# EAGLE design Board1_DustCounter (EAGLE 7.5.0)
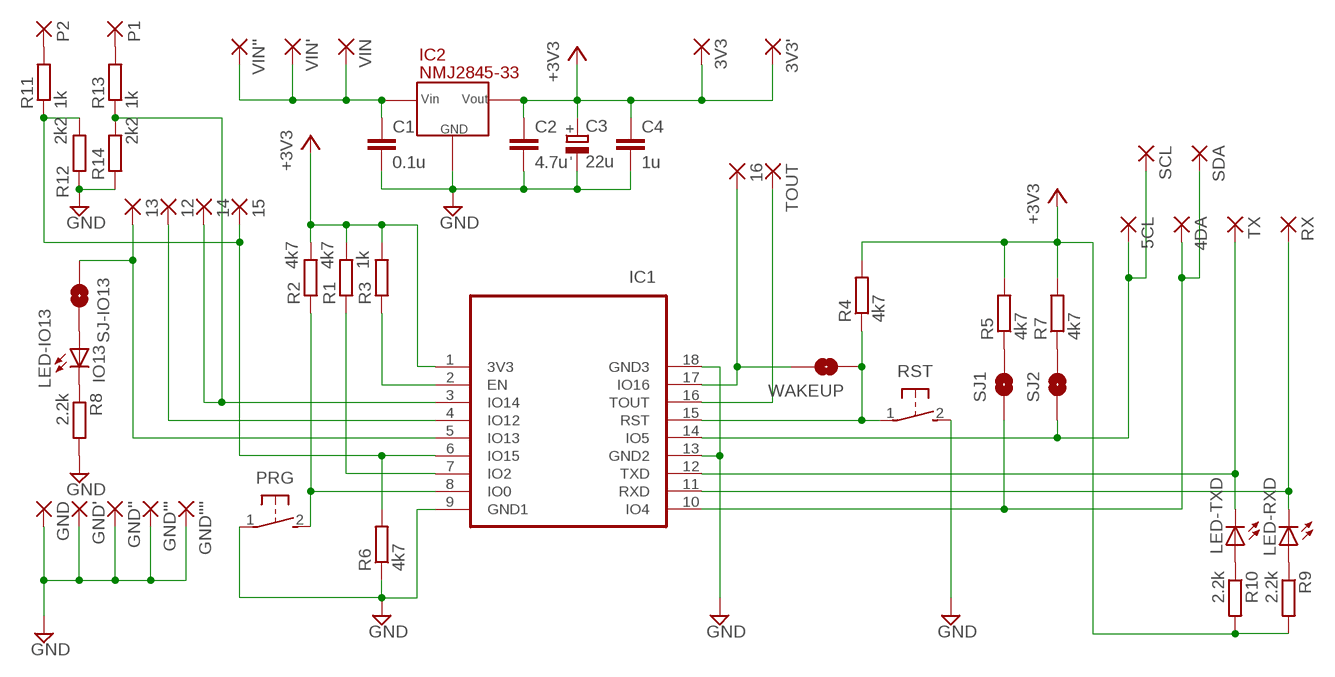
[diagram p0: schematic, sheet 1]

## Parts
3V3  1,6/0,8  [1,6/0,8]
3V3'  1,6/0,8  [1,6/0,8]
4DA  1,6/0,8  [1,6/0,8]
5CL  1,6/0,8  [1,6/0,8]
12  1,6/0,8  [1,6/0,8]
13  1,6/0,8  [1,6/0,8]
14  1,6/0,8  [1,6/0,8]
15  1,6/0,8  [1,6/0,8]
16  1,6/0,8  [1,6/0,8]
C1  0.1u  C-EUC0603  [C0603]
C2  4.7u  C-EUC0805  [C0805]
C3  22u  OS-CON/C6C  [C6]
C4  1u  C-EUC0603  [C0603]
GND  1,6/0,8  [1,6/0,8]
GND'  1,6/0,8  [1,6/0,8]
GND''  1,6/0,8  [1,6/0,8]
GND'''  1,6/0,8  [1,6/0,8]
GND''''  1,6/0,8  [1,6/0,8]
IC1  ESP-WROOM-02FRONT-FACE  [FRONT-FACE]
IC2  NMJ2845-33  NJM2845DL1  [TO-252-3]
LED-IO13  IO13  LEDCHIP-LED0603  [CHIP-LED0603]
LED-RXD  R  LEDCHIP-LED0603  [CHIP-LED0603]
LED-TXD  T  LEDCHIP-LED0603  [CHIP-LED0603]
P1  1,6/0,8  [1,6/0,8]
P2  1,6/0,8  [1,6/0,8]
PRG  SWITCH-TACTILESW  [SWITCH-TACTILE]
R1  4k7  R-EU_R0603  [R0603]
R2  4k7  R-EU_R0603  [R0603]
R3  1k  R-EU_R0603  [R0603]
R4  4k7  R-EU_R0603  [R0603]
R5  4k7  R-EU_R0603  [R0603]
R6  4k7  R-EU_R0603  [R0603]
R7  4k7  R-EU_R0603  [R0603]
R8  2.2k  R-EU_R0603  [R0603]
R9  2.2k  R-EU_R0603  [R0603]
R10  2.2k  R-EU_R0603  [R0603]
R11  1k  R-EU_R0603  [R0603]
R12  2k2  R-EU_R0603  [R0603]
R13  1k  R-EU_R0603  [R0603]
R14  2k2  R-EU_R0603  [R0603]
RST  SWITCH-TACTILESW  [SWITCH-TACTILE]
RX  1,6/0,8  [1,6/0,8]
SCL  1,6/0,8  [1,6/0,8]
SDA  1,6/0,8  [1,6/0,8]
SJ1  SDA/PU  SOLDERJUMPERNO  [SJ_2S-NO]
SJ2  SCL/PU  SOLDERJUMPERNO  [SJ_2S-NO]
SJ-IO13  SOLDERJUMPERNO  [SJ_2S-NO]
TOUT  1,6/0,8  [1,6/0,8]
TX  1,6/0,8  [1,6/0,8]
VIN  1,6/0,8  [1,6/0,8]
VIN'  1,6/0,8  [1,6/0,8]
VIN''  1,6/0,8  [1,6/0,8]
WAKEUP  SOLDERJUMPERNO  [SJ_2S-NO]

## Nets
+3V3 [3V3]: 3V3'.1(P) 3V3.1(P) C2.1 C3.+ C4.1 IC1.1(3V3) IC2.VOUT R1.2 R2.2 R3.2 R4.2 R5.2 R7.2 R9.2 R10.2
GND [GND]: C1.2 C2.2 C3.- C4.2 GND''''.1(P) GND'''.1(P) GND''.1(P) GND'.1(P) GND.1(P) IC1.9(GND1) IC1.13(GND2) IC1.18(GND3) IC2.GND PRG.1 R6.1 R8.2 R12.1 R14.1 RST.2
N$1: IC1.2(EN) R3.1
N$2: IC1.8(IO0) PRG.2 R2.1
N$3: IC1.7(IO2) R1.1
N$4: 4DA.1(P) IC1.10(IO4) SDA.1(P) SJ1.1
N$5: IC1.11(RXD) LED-RXD.C RX.1(P)
N$6: IC1.12(TXD) LED-TXD.C TX.1(P)
N$7: 5CL.1(P) IC1.14(IO5) SCL.1(P) SJ2.1
N$8: IC1.15(RST) R4.1 RST.1 WAKEUP.1
N$9: IC1.16(TOUT) TOUT.1(P)
N$10: 16.1(P) IC1.17(IO16) WAKEUP.2
N$11: R5.1 SJ1.2
N$12: R7.1 SJ2.2
N$13: LED-IO13.A SJ-IO13.2
N$15: 12.1(P) IC1.4(IO12)
N$16: LED-IO13.C R8.1
N$17 [Vin]: C1.1 IC2.VIN VIN''.1(P) VIN'.1(P) VIN.1(P)
N$18: 13.1(P) IC1.5(IO13) SJ-IO13.1
N$19: 14.1(P) IC1.3(IO14) R13.1 R14.2
N$22: LED-TXD.A R10.1
N$23: P2.1(P) R11.2
N$24: LED-RXD.A R9.1
N$25: P1.1(P) R13.2
N$26: 15.1(P) IC1.6(IO15) R6.2 R11.1 R12.2

## Library data of the parts
3V3 3V3' 4DA 5CL 12-16 GND GND' GND'' GND''' GND'''' P1 P2 RX SCL SDA TOUT TX VIN VIN' VIN'' = wirepad:1,6/0,8: THROUGH-HOLE PAD
C1 C4 = _temp:C-EU: CAPACITOR, European symbol
C2 = resistor:C-EU: CAPACITOR, European symbol
C3 = OS-CON:OS-CON/C6
IC1 = esp-wroom-02:ESP-WROOM-02: WiFi module - ESP-WROOM-02
IC2 = NJM2845DL1:NJM2845DL1: New JRC NJM2845DL1 LDO Three-terminal regulator.
LED-IO13 LED-RXD LED-TXD = adafruit:LED: LED OSRAM: - CHIPLED LG R971, LG N971, LY N971, LG Q971, LY Q971, LO R971, LY R971 LH N974, LH R974 LS Q976, LO Q976, LY Q976 LO Q996 - Hyper CHIPLED LW Q18S LB Q993, LB Q99A, LB R99A - SideLED LS A670, LO A670, LY A670, LG A670, LP A670 LB A673, LV A673, LT A673, LW A673 LH A674 LY A675 LS A676, LA A676, LO A676, LY A676, LW A676 LS A679, LY A679, LG A679 - Hyper Micro SIDELED® LS Y876, LA Y876, LO Y876, LY Y876 LT Y87S - SmartLED LW L88C, LW L88S LB L89C, LB L89S, LG L890 LS L89K, LO L89K, LY L89K LS L896, LA L896, LO L896, LY L896 - TOPLED LS T670, LO T670, LY T670, LG T670, LP T670 LSG T670, LSP T670, LSY T670, LOP T670, LYG T670 LG T671, LOG T671, LSG T671 LB T673, LV T673, LT T673, LW T673 LH T674 LS T676, LA T676, LO T676, LY T676, LB T676, LH T676, LSB T676, LW T676 LB T67C, LV T67C, LT T67C, LS T67K, LO T67K, LY T67K, LW E67C LS E67B, LA E67B, LO E67B, LY E67B, LB E67C, LV E67C, LT E67C LW T67C LS T679, LY T679, LG T679 LS T770, LO T770, LY T770, LG T770, LP T770 LB T773, LV T773, LT T773, LW T773 LH T774 LS E675, LA E675, LY E675, LS T675 LS T776, LA T776, LO T776, LY T776, LB T776 LHGB T686 LT T68C, LB T68C - Hyper Mini TOPLED® LB M676 - Mini TOPLED Santana® LG M470 LS M47K, LO M47K, LY M47K Source: http://www.osram.convergy.de/
PRG RST = tact-switch-2p:SWITCH-TACTILE: tactile switch - 2p
R1-R14 = _temp:R-EU_: RESISTOR, European symbol
SJ1 SJ2 SJ-IO13 WAKEUP = SparkFun:SOLDERJUMPER: Solder Jumper Standard SMD solder jumper. Used to automate production. Two varients : Normally Open and Normally Closed are the same, but have different paste layers. NC will have a large amount of paste and should jumper during reflow.

## Net classes
1 GND: width 0.61 mm
2 3V3: width 0.61 mm
3 Vin: width 0.61 mm

## Board
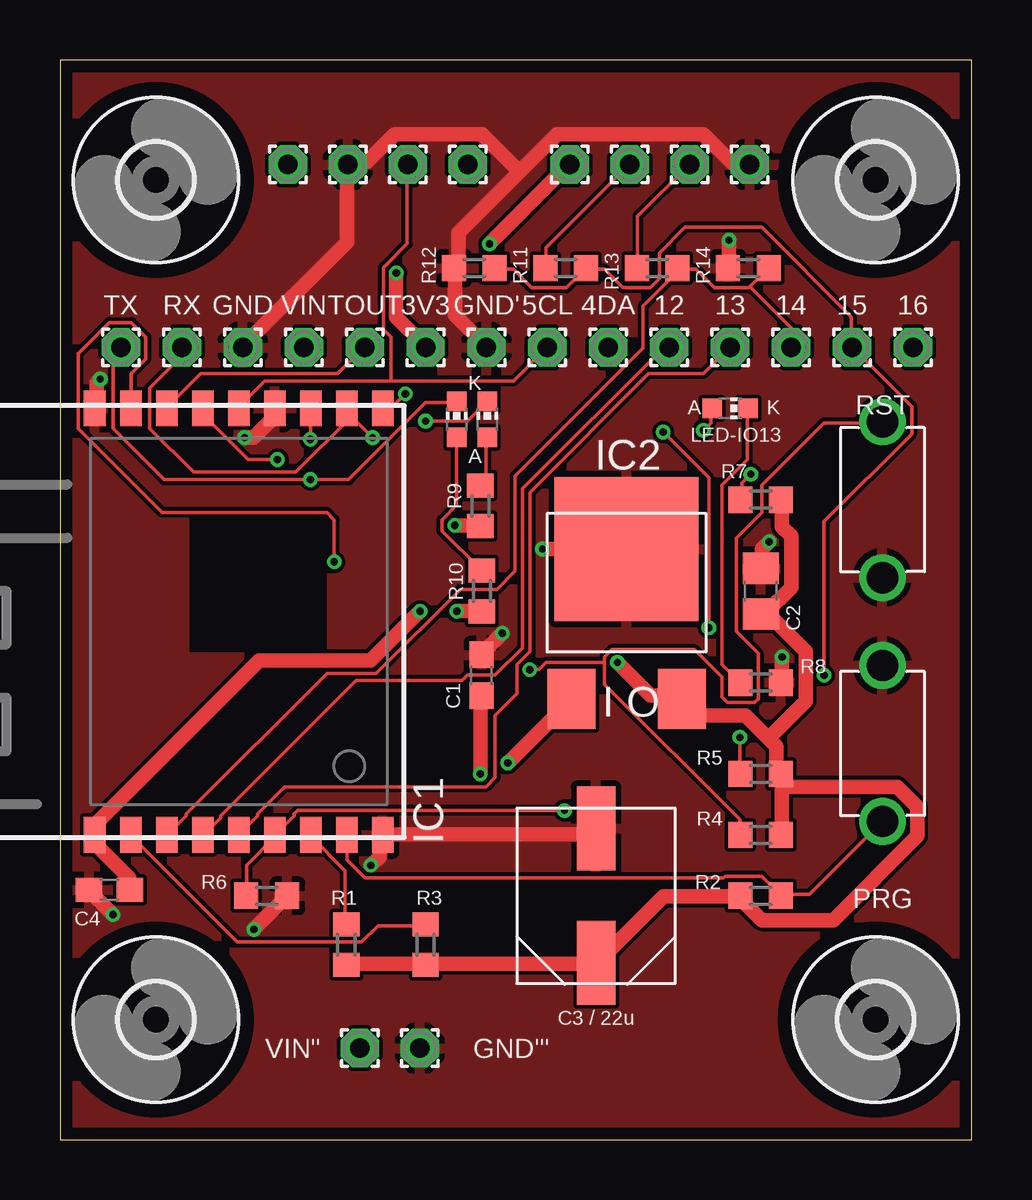
[diagram p1: board, top side]
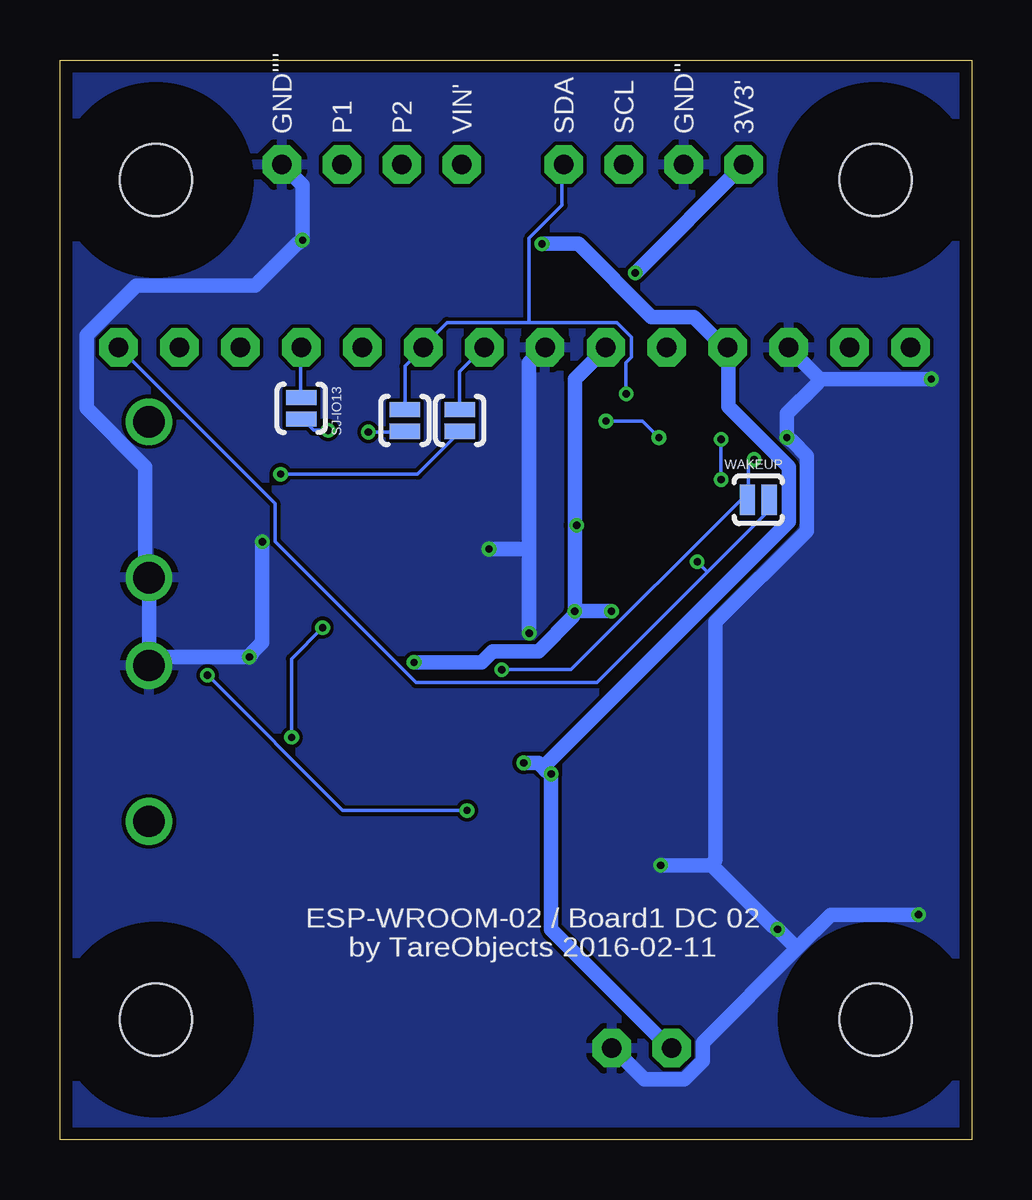
[diagram p2: board, bottom side, seen from below]

Size 38 x 45 mm. Coordinates in mm from the lower left corner, seen from the top.
Outline: 0,0 38,0 38,45 0,45 0,0
Copper layers (1*16): Top 0.035mm / dielectric 1.6mm / Bottom 0.035mm
Design rules "Elecrow_2-layer_PCB_eagle_rule": minimum track width 6mil, minimum drill 12mil, track to track 6mil, track to pad 6mil, pad to pad 6mil, via to via 8mil, smd to smd 0mil, copper to edge 20mil, drill to drill 10mil, minimum pad ring 6mil, minimum via ring 6mil, stop-mask expansion 0mil, vias tented up to drill 100mil, thermal gap 10mil

### Footprints (pad centres in the part's own frame; a part is rotated, then mirrored left to right if it is on the bottom)
1,6/0,8 = drill 0.813 pad 1.6 octagon: 1 0,0
C0603 = smd 1.1 x 1: 1 -0.85,0; 2 0.85,0
C0805 = smd 1.3 x 1.5: 1 -0.95,0; 2 0.95,0
C6 = smd 1.6 x 3.5: + 0,-2.8; - 0,2.8
FRONT-FACE = smd 1.485 x 0.9: 1 -8.893,4.9; 2 -8.893,3.4; 3 -8.893,1.9; 4 -8.893,0.4; 5 -8.893,-1.1; 6 -8.893,-2.6; 7 -8.893,-4.1; 8 -8.893,-5.6; 9 -8.893,-7.1; 10 8.893,-7.1; 11 8.893,-5.6; 12 8.893,-4.1; 13 8.893,-2.6; 14 8.893,-1.1; 15 8.893,0.4; 16 8.893,1.9; 17 8.893,3.4; 18 8.893,4.9
TO-252-3 = smd 6 x 6: GND 0,1.5 | smd 2 x 2.5: VIN -2.3,-4.75; VOUT 2.3,-4.75
CHIP-LED0603 = smd 0.8 x 0.8: A 0,-0.75; C 0,0.75
SWITCH-TACTILE = drill 1.3: 1 -3.25,0; 2 3.25,0
R0603 = smd 1 x 1.1: 1 -0.85,0; 2 0.85,0
SJ_2S-NO = smd 0.635 x 1.27: 1 -0.45,0; 2 0.45,0
3,0 = hole 3: 0,0

### Placement (x,y rotation side)
3V3  15.24,33.02 180 top
3V3'  9.5,40.64 0 top
4DA  22.86,33.02 180 top
5CL  20.32,33.02 0 top
12  25.4,33.02 180 top
13  27.94,33.02 180 top
14  30.48,33.02 180 top
15  33.02,33.02 0 top
16  35.56,33.02 180 top
C1  17.57,19.35 90 top
C2  29.21,22.86 90 top
C3  22.35,10.16 0 top
C4  2.06,10.41 180 top
GND  7.62,33.02 0 top
GND'  17.78,33.02 0 top
GND''  12,40.64 0 top
GND'''  15,3.81 0 top
GND''''  28.75,40.64 0 top
IC1  6.35,21.59 90 top
IC2  23.62,23.11 0 top
LED-IO13  27.94,30.48 270 top
LED-RXD  17.81,30.02 0 top
LED-TXD  16.54,30.02 0 top
P1  26.25,40.64 0 top
P2  23.75,40.64 0 top
PRG  34.29,16.51 270 top
R1  11.94,8.13 270 top
R2  29.21,10.16 180 top
R3  15.24,8.13 270 top
R4  29.21,12.7 0 top
R5  29.21,15.24 0 top
R6  8.62,10.16 180 top
R7  29.21,26.67 0 top
R8  29.21,19.05 0 top
R9  17.53,26.42 270 top
R10  17.59,22.86 270 top
R11  21.08,36.32 180 top
R12  17.27,36.32 0 top
R13  24.89,36.32 180 top
R14  28.7,36.32 0 top
RST  34.29,26.67 270 top
RX  5.08,33.02 90 top
SCL  14.5,40.64 0 top
SDA  17,40.64 0 top
SJ1  23.62,29.97 270 bottom
SJ2  21.34,29.97 270 bottom
SJ-IO13  27.94,30.48 270 bottom
TOUT  12.7,33.02 180 top
TX  2.54,33.02 90 top
U$1  [3,0]  4,40 0 top
U$2  [3,0]  4,5 0 top
U$3  [3,0]  34,40 0 top
U$4  [3,0]  34,5 0 top
VIN  10.16,33.02 180 top
VIN'  21.25,40.64 0 top
VIN''  12.5,3.81 0 top
WAKEUP  8.89,26.67 0 bottom

### Tracks (layer width: path | path; a pad name or v marks a point on that pad's centre or on a via)
+3V3  (via drill 0.3)
  Top 0.61: R7.2 30.1,26.67 30.1,25.53 30.48,25.15 30.48,23.01 29.41,21.95 29.26,21.95 C2.1 29.64,21.79 31.09,20.34 31.09,18.29 29.53,16.73 | R4.2 30.1,12.72 30.1,15.24 R5.2 | 29.53,16.73 28.57,17.68 26.59,17.68 25.98,18.29 IC2.VOUT 25.68,18.52 24.61,18.52 v23.24,19.89 | 29.53,16.73 29.87,16.38 29.87,15.47 R5.2 | R1.2 11.96,7.32 15.24,7.32 R3.2 15.47,7.32 22.1,7.32 C3.+ 22.4,7.39 25.15,10.13 28.35,10.13 R2.2 28.5,9.91 29.26,9.14 32.23,9.14 35.74,12.65 35.74,13.87 34.9,14.71 30.33,14.71 R5.2 | C4.1 2.9,10.44 2.9,10.9 1.52,12.27 1.52,12.65 IC1.1 1.6,12.95 1.6,13.26 8.31,19.96 12.95,19.96 v15.01,22.02 | v16.54,22.02 17.53,22.02 R10.2 | v16.46,25.6 17.53,25.6 R9.2 | v14.02,36.12 14.02,34.29 15.24,33.07 3V3.1
  Bottom 0.61: 16.54,25.6 16.54,31.7 15.24,32.99 3V3.1 | 16.54,25.6 v16.54,22.02 | v16.46,25.6 16.54,25.6 | v16.54,22.02 v15.01,22.02 | v14.02,36.12 9.53,40.62 3V3'.1 | v23.24,19.89 20.42,19.89 19.96,20.34 18.06,20.34 16.61,21.79 v16.54,22.02
GND  (via drill 0.3)
  Top 0.61: C3.- 22.33,12.95 22.1,12.72 13.49,12.72 IC1.9 13.34,12.42 13.34,11.81 v12.95,11.43 | v2.21,9.37 1.22,10.36 C4.2 | v8.08,8.76 9.45,10.13 R6.1 | v1.68,31.7 1.52,31.55 1.52,30.56 IC1.18 | v7.7,29.26 8.08,29.26 8.91,30.1 8.91,30.48 IC1.13 | GND.1 7.62,33.07 11.96,37.41 11.96,40.62 GND''.1 12.27,40.77 12.8,40.77 13.95,41.91 17.6,41.91 19.16,40.35 | v30.1,20.12 30.1,19.05 R8.2 | v29.57,24.92 29.26,24.61 29.26,23.85 C2.2 | v27.89,37.49 27.89,36.35 R14.1 | v18.44,21.11 17.6,20.27 C1.2 | GND'.1 17.75,33.07 16.46,34.37 16.46,36.27 R12.1 16.61,36.58 16.61,37.8 19.16,40.35 | 19.16,40.35 20.73,41.91 26.82,41.91 28.04,40.69 28.73,40.69 GND''''.1 | v20.12,24.61 IC2.GND
  Bottom 0.61: v2.21,9.37 5.87,9.37 7.28,7.96 | 7.28,7.96 11.2,4.04 11.2,3.28 11.96,2.52 13.64,2.52 14.94,3.81 GND'''.1 | 7.28,7.96 v8.08,8.76 8.31,8.91 10.82,11.43 | 10.82,11.43 v12.95,11.43 | 6.33,31.7 v1.68,31.7 | 6.33,31.7 7.62,32.99 GND.1 | 6.33,31.7 6.48,31.47 7.7,30.25 v7.7,29.26 7.47,29.11 6.86,28.5 6.86,25.38 10.67,21.57 10.67,11.66 10.82,11.43 | v29.57,24.92 29.57,20.73 29.95,20.34 v30.1,20.12 33.98,20.12 34.29,19.81 PRG.1 34.14,20.34 34.29,20.5 RST.2 34.44,23.7 34.44,28.04 36.88,30.48 36.88,33.53 34.82,35.59 29.87,35.59 28.12,37.34 v27.89,37.49 27.89,39.78 28.73,40.62 GND''''.1 | 18.44,24.61 18.44,32.38 17.83,32.99 GND'.1 | 18.44,24.61 v18.44,21.11 | 18.44,24.61 v20.12,24.61
  pour Bottom: 0,0 39.37,0 39.37,45.72 0,45.72
  pour Top: 0,0 40.64,0 40.64,45.72 0,45.72
N$1
  Top 0.152: R3.1 15.24,8.91 13.26,8.91 12.57,8.23 7.39,8.23 2.97,12.65 IC1.2
N$2
  Top 0.152: PRG.2 31.24,10.21 30.1,10.21 R2.1 30.02,10.21 29.26,10.97 27.74,10.97 27.66,10.9 12.72,10.9 11.96,11.66 11.96,12.65 IC1.8
N$3
  Top 0.152: R1.1 11.89,8.99 11.89,11.2 10.44,12.65 IC1.7
N$4  (via drill 0.3)
  Top 0.152: v14.4,31.09 13.87,30.56 13.49,30.56 IC1.10
  Bottom 0.152: SJ1.1 23.62,32.23 22.86,32.99 4DA.1 22.86,33.07 21.87,34.06 18.44,34.06 | v14.4,31.09 14.4,32.38 14.17,32.61 14.17,33.45 14.78,34.06 18.44,34.06 | 18.44,34.06 18.44,37.57 17.07,38.94 17.07,40.62 SDA.1
N$5  (via drill 0.3)
  Top 0.152: v15.24,29.95 16.99,29.95 17.75,30.71 LED-RXD.C | v13.03,29.26 11.96,30.33 11.96,30.48 IC1.11 12.12,30.1 9.83,27.81 5.56,27.81 3.73,29.64 3.73,31.32 5.03,32.61 5.03,32.99 RX.1
  Bottom 0.152: v15.24,29.95 13.72,29.95 v13.03,29.26
N$6  (via drill 0.3)
  Top 0.152: TX.1 2.21,32.69 2.21,29.64 4.34,27.51 v10.44,27.51 12.04,27.51 15.24,30.71 16.54,30.71 LED-TXD.C | v10.44,29.18 IC1.12
  Bottom 0.152: v10.44,27.51 v10.44,29.18
N$7
  Top 0.152: 13.79,31.62 18.9,31.62 20.27,32.99 5CL.1 | 13.79,31.62 8.53,31.62 7.47,30.56 IC1.14 | 13.79,31.62 13.79,33.45 13.49,33.76 13.49,36.35 14.48,37.34 14.48,40.62 SCL.1
  Bottom 0.152: SJ2.1 21.34,32 5CL.1
N$8  (via drill 0.3)
  Top 0.152: v9.07,28.35 7.85,28.35 6.02,30.18 6.02,30.48 IC1.15 | 22.71,19.89 22.71,20.12 23.01,20.42 26.44,20.42 27.58,19.28 27.58,18.44 27.81,18.21 28.96,18.21 29.11,18.36 29.11,20.27 28.19,21.18 28.19,25.07 29.26,26.14 29.26,27.28 31.85,29.87 34.29,29.87 RST.1 | 22.71,19.89 22.71,18.97 28.35,13.34 28.35,12.72 R4.1 | v19.58,19.58 19.96,19.58 20.27,19.89 22.71,19.89
  Bottom 0.152: v9.07,28.35 9.3,28.12 9.3,26.67 WAKEUP.1 9.6,26.67 16.69,19.58 v19.58,19.58
N$9
  Top 0.152: IC1.16 4.5,30.56 5.87,31.93 11.58,31.93 12.65,32.99 TOUT.1
N$10  (via drill 0.3)
  Top 0.152: v11.43,24.08 11.43,25.83 11.12,26.14 4.27,26.14 0.76,29.64 0.76,32.77 2.06,34.06 2.97,34.06 3.58,33.45 3.58,32.54 2.97,31.93 2.97,30.56 IC1.17
  Bottom 0.152: 11.01,23.66 15.62,19.05 23.16,19.05 29.03,24.92 29.03,26.52 35.51,32.99 16.1 | 11.01,23.66 8.46,26.21 8.46,26.67 WAKEUP.2 | 11.01,23.66 v11.43,24.08
N$11  (via drill 0.3)
  Top 0.152: v28.35,16.76 28.35,15.24 R5.1 | v27.05,21.34 27.05,27.58 v25.15,29.49
  Bottom 0.152: v28.35,16.76 28.35,20.04 v27.05,21.34 | v25.15,29.49 23.62,29.49 SJ1.2
N$12  (via drill 0.3)
  Top 0.152: v28.8,27.74 28.42,27.36 28.42,26.67 R7.1
  Bottom 0.152: v28.8,27.74 23.09,27.74 21.34,29.49 SJ2.2
N$13  (via drill 0.3)
  Top 0.152: v26.82,29.57 27.13,29.87 27.13,30.48 LED-IO13.A
  Bottom 0.152: v26.82,29.57 27.43,29.57 27.89,30.02 SJ-IO13.2
N$15
  Top 0.152: IC1.4 6.02,12.72 6.71,13.41 6.71,13.49 12.34,19.13 16.76,19.13 16.99,19.36 18.14,19.36 19.28,20.5 19.28,27.13 25.15,32.99 25.38,32.99 12.1
N$16
  Top 0.152: LED-IO13.C 28.65,30.48 28.65,28.35 27.58,27.28 27.58,19.81 28.35,19.05 R8.1
N$17  (via drill 0.3)
  Top 0.61: v17.53,15.24 17.53,18.44 C1.1 | v18.67,15.7 21.26,18.29 IC2.VIN | v17.91,37.34 21.18,40.62 VIN'.1
  Bottom 0.61: VIN''.1 12.57,3.81 17.53,8.76 v17.53,15.24 17.75,15.39 17.87,15.51 | v18.67,15.7 18.06,15.7 17.87,15.51 | 17.87,15.51 7.62,25.76 7.62,28.04 10.13,30.56 10.13,32.99 VIN.1 10.44,33.15 11.58,34.29 13.34,34.29 16.38,37.34 v17.91,37.34
N$18
  Top 0.152: IC1.5 7.47,12.72 8.23,13.49 8.23,13.56 9.37,14.71 17.75,14.71 18.14,15.09 18.14,17.68 19.05,18.59 19.05,19.81 19.58,20.34 19.58,26.98 24.54,31.93 26.82,31.93 27.89,32.99 13.1
  Bottom 0.152: SJ-IO13.1 27.96,30.94 27.96,32.99 13.1
N$19
  Top 0.152: 28.77,35.55 29.49,36.27 R14.2 | 28.77,35.55 28.73,35.51 27.28,35.51 26.52,36.27 25.76,36.27 R13.1 25.76,36.2 24.31,34.75 24.31,32.99 18.97,27.66 18.97,23.7 18.21,22.94 16.69,22.94 13.18,19.43 11.12,19.43 5.26,13.56 5.26,13.49 4.5,12.72 IC1.3 | 14.1 30.48,33.83 28.77,35.55
N$22
  Top 0.152: LED-TXD.A 16.54,26.44 15.93,25.83 15.93,25.38 17.53,23.77 R10.1
N$23
  Top 0.152: R11.2 20.27,36.35 20.27,37.19 23.7,40.62 P2.1
N$24
  Top 0.152: LED-RXD.A 17.75,29.26 17.75,27.51 R9.1
N$25
  Top 0.152: R13.2 24.08,36.35 24.08,38.48 26.21,40.62 P1.1
N$26  (via drill 0.3)
  Top 0.152: R6.2 7.77,10.21 7.77,11.43 8.99,12.65 IC1.6 8.99,12.72 9.75,13.49 9.75,13.56 9.91,13.72 v21.03,13.72 | R12.2 18.14,36.27 18.9,36.27 19.66,35.51 21.11,35.51 21.87,36.27 R11.1 21.95,36.27 22.71,36.27 23.47,35.51 24.61,35.51 24.99,35.89 24.99,36.96 26.06,38.02 29.26,38.02 32.99,34.29 32.99,33.07 15.1 33.07,32.99 35.51,30.56 35.51,29.41 31.85,25.76 v31.85,19.36
  Bottom 0.152: v21.03,13.72 26.21,13.72 v31.85,19.36

### Text on the board
tNames: K | A | K | A | C3 / 22u
bNames: ESP-WROOM-02 / Board1 DC 02 / by TareObjects 2016-02-11